# Altium schematic sheet POWER.SchDoc
size A4; SheetNumber: 2; SheetTotal: 2
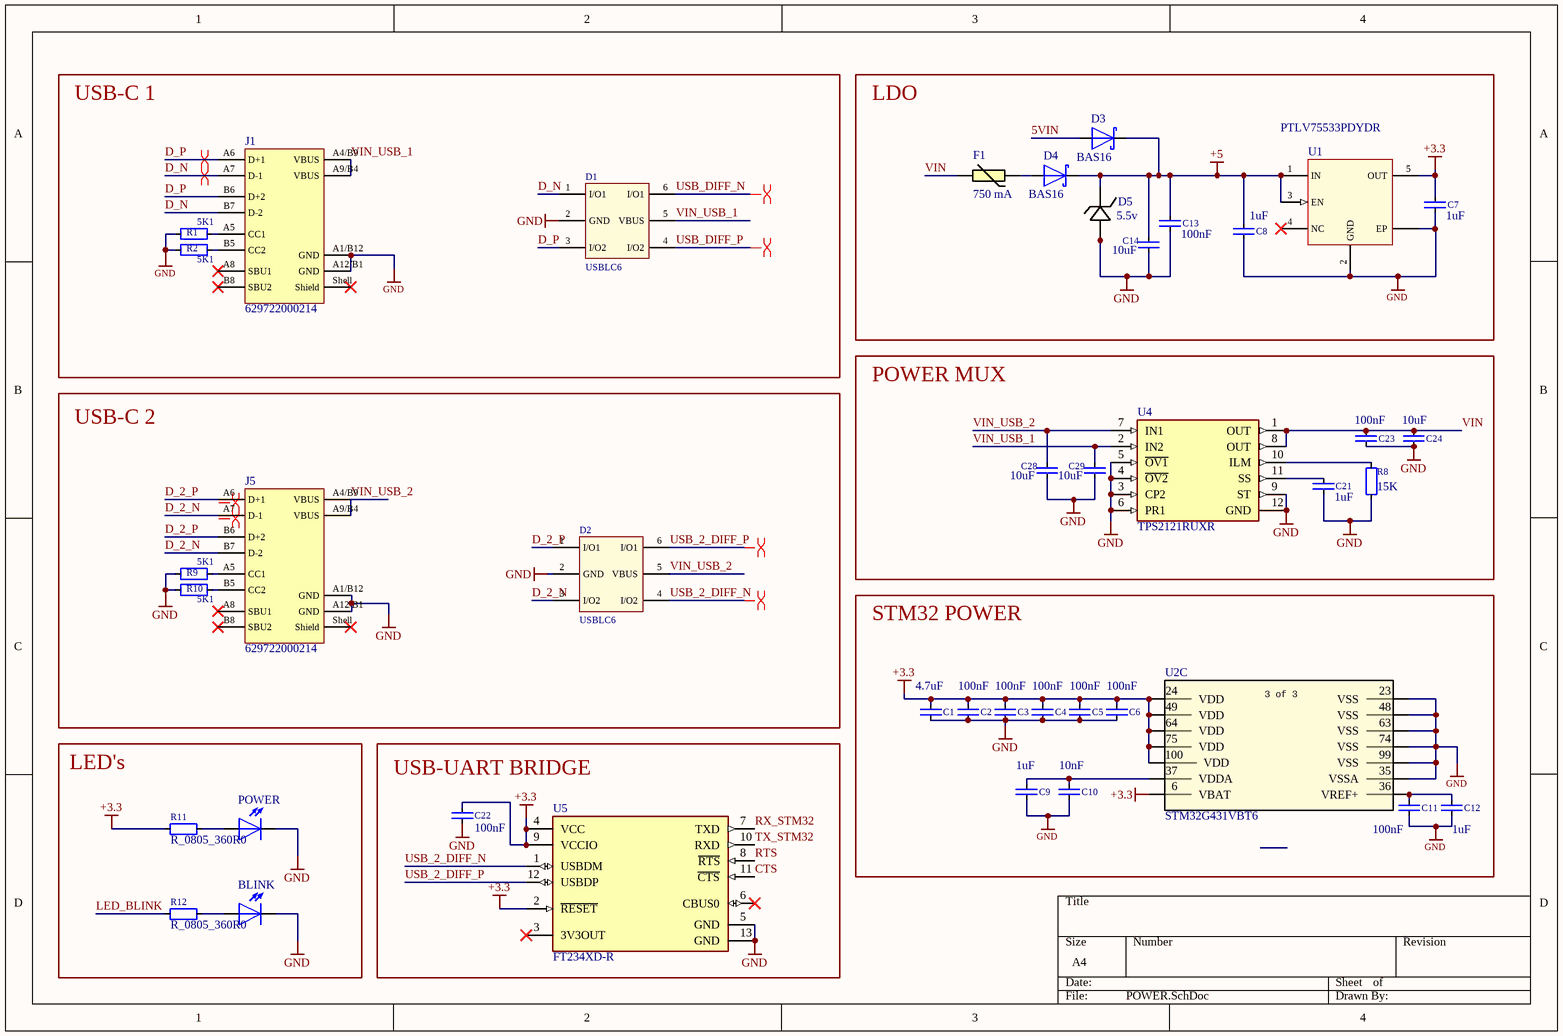
[diagram p0: POWER.SchDoc]

## Parts
BLINK  LED_1206_GREEN  [WL-SMRW_1205_normal use]  (value not drawn)
C1  Displayed Value: 4.7uF  [SMD_1026_footprint]  (hidden comment: C_1206_4u70_X7R_25V)
C2  Displayed Value: 100nF  [SMD_0805_footprint]  (hidden comment: C_0805_100n0_X7R)
C3  Displayed Value: 100nF  [SMD_0805_footprint]  (hidden comment: C_0805_100n0_X7R)
C4  Displayed Value: 100nF  [SMD_0805_footprint]  (hidden comment: C_0805_100n0_X7R)
C5  Displayed Value: 100nF  [SMD_0805_footprint]  (hidden comment: C_0805_100n0_X7R)
C6  Displayed Value: 100nF  [SMD_0805_footprint]  (hidden comment: C_0805_100n0_X7R)
C7  Displayed Value: 1uF  [SMD_0805_footprint]  (hidden comment: C_0805_1u00_X7R_16V)
C8  Displayed Value: 1uF  [SMD_0805_footprint]  (hidden comment: C_0805_1u00_X7R_16V)
C9  Displayed Value: 1uF  [SMD_0805_footprint]  (hidden comment: C_0805_1u00_X7R_16V)
C10  Displayed Value: 10nF  [SMD_0805_footprint]  (hidden comment: C_0805_10n00_X7R_50V)
C11  Displayed Value: 100nF  [SMD_0805_footprint]  (hidden comment: C_0805_100n0_X7R)
C12  Displayed Value: 1uF  [SMD_0805_footprint]  (hidden comment: C_0805_1u00_X7R_16V)
C13  Displayed Value: 100nF  [SMD_0805_footprint]  (hidden comment: C_0805_100n0_X7R)
C14  Displayed Value: 10uF  [SMD_1026_footprint]  (hidden comment: C_1206_10u0_X7R_25V)
C21  Displayed Value: 1uF  [SMD_0805_footprint]  (hidden comment: C_0805_1u00_X7R_16V)
C22  Displayed Value: 100nF  [SMD_0805_footprint]  (hidden comment: C_0805_100n0_X7R)
C23  Displayed Value: 100nF  [SMD_0805_footprint]  (hidden comment: C_0805_100n0_X7R)
C24  Displayed Value: 10uF  [SMD_1026_footprint]  (hidden comment: C_1206_10u0_X7R_25V)
C28  Displayed Value: 10uF  [SMD_1026_footprint]  (hidden comment: C_1206_10u0_X7R_25V)
C29  Displayed Value: 10uF  [SMD_1026_footprint]  (hidden comment: C_1206_10u0_X7R_25V)
D1  Displayed Value: USBLC6  [SOT23-6L_V]  (hidden comment: USBLC6-2SC6)
D2  Displayed Value: USBLC6  [SOT23-6L_V]  (hidden comment: USBLC6-2SC6)
D3  Displayed Value: BAS16  [ONSC-SOT-23-3-318-08_V]  (hidden comment: BAS16LT3G)
D4  Displayed Value: BAS16  [ONSC-SOT-23-3-318-08_V]  (hidden comment: BAS16LT3G)
D5  Displayed Value: 5.5v  [D5V0H1U2LP1610-7]  (hidden comment: D5V0H1U2LP1610-7)
F1  Displayed Value: 750 mA  [0ZCG0075FF2C]  (hidden comment: 0ZCG0075FF2C)
J1  629722000214  [629722000214]
J5  629722000214  [629722000214]
POWER  LED_1206_GREEN  [WL-SMRW_1205_normal use]  (value not drawn)
R1  Displayed Value: 5K1  [SMD_0805_footprint]  (hidden comment: R_0805_5K10)
R2  Displayed Value: 5K1  [SMD_0805_footprint]  (hidden comment: R_0805_5K10)
R8  Displayed Value: 15K  [SMD_0805_footprint]  (hidden comment: R_0805_15K_0.125W)
R9  Displayed Value: 5K1  [SMD_0805_footprint]  (hidden comment: R_0805_5K10)
R10  Displayed Value: 5K1  [SMD_0805_footprint]  (hidden comment: R_0805_5K10)
R11  R_0805_360R0  [SMD_0805_footprint]
R12  R_0805_360R0  [SMD_0805_footprint]
U1  PTLV75533PDYDR  [DYD0005A-MFG]
U2  STM32G431VBT6  [LQFP100]  (part C of 3)
U4  TPS2121RUXR  [FP-RUX0012A-MFG]
U5  FT234XD-R  [FP-DFN-12-MFG]

## Blocks framed on the sheet
USB-C 1: D1 J1 R1 R2
LDO: C7 C8 C13 C14 D3-D5 F1 U1
POWER MUX: C21 C23 C24 C28 C29 R8 U4
USB-C 2: D2 J5 R9 R10
STM32 POWER: C1-C6 C9-C12 U2
LED's: BLINK POWER R11 R12
USB-UART BRIDGE: C22 U5

## Nets
+3.3: C1.2 C2.2 C3.2 C4.2 C5.2 C6.2 C7.2 C22.1 R11.1 U1.5(OUT) U2.6(VBAT) U2.24(VDD) U2.49(VDD) U2.64(VDD) U2.75(VDD) U2.100(VDD) U5.2(~{RESET}) U5.4(VCC) U5.9(VCCIO)
+5: C8.2 C13.2 C14.2 D3.3(K) D4.3(K) D5.1 U1.1(IN) U1.3(EN)
GND: BLINK.1(K) C1.1 C2.1 C3.1 C4.1 C5.1 C6.1 C7.1 C8.1 C9.1 C10.1 C11.1 C12.1 C13.1 C14.1 C21.1 C22.2 C23.1 C24.1 C28.1 C29.1 D1.2(GND) D2.2(GND) D5.2 J1.A1/B12(GND) J1.A12/B1(GND) J5.A1/B12(GND) J5.A12/B1(GND) POWER.1(K) R1.1 R2.1 R8.1 R9.1 R10.1 U1.2(GND) U1.EP U2.23(VSS) U2.35(VSSA) U2.48(VSS) U2.63(VSS) U2.74(VSS) U2.99(VSS) U4.3(CP2) U4.4(~{OV2}) U4.5(~{OV1}) U4.6(PR1) U4.9(ST) U4.12(GND) U5.5(GND) U5.13(GND)
5VIN: D3.1(A)
CTS: U5.11(~{CTS})
D_2_N: D2.3(I/O2) J5.A7(D-1) J5.B7(D-2)
D_2_P: D2.1(I/O1) J5.A6(D+1) J5.B6(D+2)
D_N: D1.1(I/O1) J1.A7(D-1) J1.B7(D-2)
D_P: D1.3(I/O2) J1.A6(D+1) J1.B6(D+2)
LED_BLINK: R12.1
RTS: U5.8(~{RTS})
RX_STM32: U5.7(TXD)
TX_STM32: U5.10(RXD)
USB_2_DIFF_N: D2.4(I/O2) U5.1(USBDM)
USB_2_DIFF_P: D2.6(I/O1) U5.12(USBDP)
USB_DIFF_N: D1.6(I/O1)
USB_DIFF_P: D1.4(I/O2)
VIN: C23.2 C24.2 F1.2 U4.1(OUT) U4.8(OUT)
VIN_USB_1: C29.2 D1.5(VBUS) J1.A4/B9(VBUS) J1.A9/B4(VBUS) U4.2(IN2)
VIN_USB_2: C28.2 D2.5(VBUS) J5.A4/B9(VBUS) J5.A9/B4(VBUS) U4.7(IN1)
NetBLINK_2: BLINK.2(A) R12.2
NetC9_2: C9.2 C10.2 U2.37(VDDA)
NetC11_2: C11.2 C12.2 U2.36(VREF+)
NetC21_2: C21.2 U4.11(SS)
NetD4_1: D4.1(A) F1.1
NetJ1_A5: J1.A5(CC1) R1.2
NetJ1_B5: J1.B5(CC2) R2.2
NetJ5_A5: J5.A5(CC1) R9.2
NetJ5_B5: J5.B5(CC2) R10.2
NetPOWER_2: POWER.2(A) R11.2
NetR8_2: R8.2 U4.10(ILM)

Not connected (* = marked no-connect by the designer): J1 A8(SBU1)* B8(SBU2)* Shell(Shield)*; J5 A8(SBU1)* B8(SBU2)* Shell(Shield)*; U1 4(NC)*; U5 3(3V3OUT)* 6(CBUS0)*

## Layout directives
differential pair: (no net found under the mark), D_N, D_P, USB_2_DIFF_N, USB_2_DIFF_P
differential pair; differential pair class USB_DIFF: USB_DIFF_N, USB_DIFF_P

## Notes on the sheet
- (in symbol CMP-00274-1, part C) 3 of 3

## Library data of the parts
BLINK POWER = CMP-00090-5: LED, SMD, 1206, green; Manufacturer: Würth Elektronik; Manufacturer Part Number: 156120GS75000; Displayed Value: LED green
C1 = CMP-00046-7: Ceramic Capacitor, Multilayer, Ceramic, 25V, 10% +Tol, 10% -Tol, X7R, 15% TC, 4.7uF, Surface Mount, 1206; Manufacturer Part Number: 12063C475KAT4A; Manufacturer: AVX Kyocera
C2-C6 C11 C13 C22 C23 = CMP-00043-7: Ceramic Capacitor, Multilayer, Ceramic, 50V, 10% +Tol, 10% -Tol, X7R, 15% TC, 0.1uF, Surface Mount, 0805; Manufacturer Part Number: 885012207098; Manufacturer: Würth Elektronik
C7-C9 C12 C21 = CMP-00037-7: Ceramic Capacitor 1uF 16V 10% X7R SMD 0805; Manufacturer: multicomp Pro; Manufacturer Part Number: MC0805B105K160CT
C10 = CMP-035-000003-2: Multilayer Ceramic Capacitor 0.01uF 0805; Manufacturer: Würth Elektronik; Manufacturer Part Number: 8850 1220 7092
C14 C24 C28 C29 = CMP-00031-9: 10μF ±10% 25V Ceramic Capacitor X7R 1206 (3216 Metric); Manufacturer Part Number: 885012208069; Manufacturer: Würth Elektronik
D1 D2 = CMP-060-000002-2: 5A 17V 6V Unidirectional 5.25V SOT-23-6L ESD and Surge Protection (TVS/ESD) ROHS; Manufacturer: ST Microelectronics; Manufacturer Part Number: USBLC6-2SC6
D3 D4 = CMP-005-000000-1: Rectifier Diode Small Signal Switching 0.2A 6ns 3-Pin SOT-23 T/R; Manufacturer: Onsemi; Manufacturer Part Number: BAS16LT3G
D5 = CMP-00306-1: TVS Diode; Manufacturer: Diodes Incorporated; Manufacturer Part Number: D5V0H1U2LP1610-7; Datasheet: chrome-extension://efaidnbmnnnibpcajpcglclefindmkaj/https://www.diodes.com/assets/Datasheets/D5V0H1U2LP1610.pdf
F1 = CMP-00289-1: Polymérique PTC Resettable Fuse 16V 750 mA Ih Montage en surface 1812; Manufacturer: Bel Fuse Inc.; Manufacturer Part Number: 0ZCG0075FF2C; Datasheet: https://www.belfuse.com/media/datasheets/products/circuit-protection/ds-cp-0zcg-series.pdf
J1 J5 = CMP-00007-14: Usb Conn, R/a, Type C 2.0, Rcpt, 16POS Rohs Compliant: Yes; pin to pad: Shell>1+2+3+4; Manufacturer: Würth Elektronik; Datasheet: https://www.we-online.com/components/products/datasheet/629722000214.pdf; Manufacturer Part Number: 629722000214
R1 R2 R9 R10 = CMP-067-000002-3: Res Thick Film 0805 5.1K Ohm 1% 1/8W ±100ppm/°C Molded SMD Punched Carrier T/R; Manufacturer Part Number: ERJ-6ENF5101V; Manufacturer: Panasonic
R8 = CMP-00139-1: Res Thick Film 0805 1.5K Ohm 1% 0.125W(1/8W) +/-100ppm/C Molded SMD Automotive Punched T/R; Manufacturer Part Number: ERJ-6ENF1501V; Manufacturer: Panasonic
R11 R12 = CMP-00089-2: Res Thick Film 0805 360 Ohm 1% 0.125W ±100ppm/°C Molded SMD Punched Carrier T/R; Manufacturer Part Number: ERJ-6ENF3600V; Manufacturer: Panasonic; Displayed Value: 360R
U1 = CMP-001-0003-4: 500-mA high-PSRR low-IQ low-dropout voltage regulator with enable 5-SOT-23 -40 to 125; pin to pad: EP>EP+EP_1+EP_2+EP_3+EP_4+EP_5+EP_6; Manufacturer: Texas Instruments; Displayed Value: PTLV75533PDYDR; Manufacturer Part Number: PTLV75533PDYDR
U2 = CMP-00274-1: Microcontroller 32-Bit ARM Cortex-M4 RISC 128KB Flash 1.71V to 3.6V 100-Pin LQFP; Number of USART Channels: 3; Peripherals: POR; Operating Supply Voltage: 3V; Number of Interrupts: 16; Interface: UART, USB; Number of I/Os: 6; Number of Channels: 23; DAC Channels (Resolution): 4-Ch 12-Bit; ADC Channels (Resolution): 23-Ch 12-Bit; RAM Size: 32kB; Frequency: 170MHz; Number of D/A Converters: 2; Number of UART Channels: 1; Clock Frequency: 48MHz; EEPROM Memory Size: 0B; Max Supply Current: 29mA; Number of Timers/Counters: 12; Memory Format: FLASH; Width: 14mm; Height - Seated (Max): 1.6mm; Lifecycle Status: Production; Number of Terminals: 100; Case/Package: LFQFP; Export Control Classification Number (ECCN) Code: 3A991.A.2; Introduction Date: 2019-10-29; Number of SPI Channels: 3; Min Operating Temperature: -40°C; China RoHS: Compliant; Max Supply Voltage: 3.6V; Country of Origin: Mainland China, Malaysia, Philippines, Taiwan; Min Supply Voltage: 1.71V; Number of A/D Converters: 2; Length: 14mm; RoHS: Compliant; Harmonized Tariff Schedule (HTS) Code: 8542.31.00.25; REACH SVHC: Yes; Terminal Pitch: 500µm; Max Operating Temperature: 85°C; Core Architecture: ARM Cortex-M4; Number of I2C Channels: 3; Flash Memory Size: 128kB
U4 = CMP-00297-1: 2.7-V to 22-V, 56-mΩ, 4.5-A, power mux with seamless switchover 12-VQFN-HR -40 to 125
U5 = CMP-00296-1: Tape & Reel (TR) 2006 UART USB 2.0 interface controller 2.97V~5.5V 800mum 8mA 3Mbps; Clock Frequency: 12MHz; Max Supply Current: 8.3mA; Number of Ports: 1; Operating Supply Voltage: 5V; Min Supply Voltage: 2.97V; USB Standard: USB 2.0; Interface: UART, USB; Data Rate: 60Mbps; Max Supply Voltage: 5.5V; Width: 3mm; Ambient Temperature Range High: 85°C; Mounting Technology: Surface Mount; Case/Package: DFN; Max Operating Temperature: 85°C; Schedule B: 8542390000, 8542390000; Length: 3mm; Number of Terminals: 12; Pins: 12; REACH SVHC: Yes; Number of Transceivers: 1; Min Operating Temperature: -40°C; Lifecycle Status: Production; Height - Seated (Max): 800µm; Nominal Supply Current: 8mA; Height: 800µm; Terminal Pitch: 450µm; RoHS: Compliant; Temperature Grade: Industrial; Operating Supply Current: 8mA; Lead Free: Lead Free